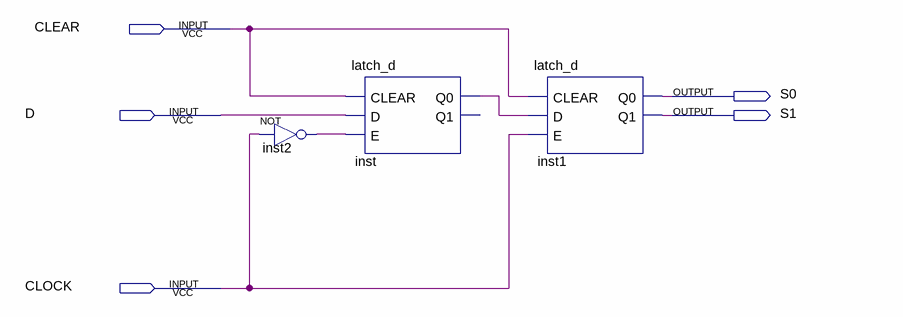
[diagram p0: schematic sheet]
// Quartus schematic flipflop_subida.bdf as structural Verilog: 3 symbols, 5 pins
module flipflop_subida (
  input  CLEAR,
  input  D,
  input  CLOCK,
  output S0,
  output S1
);

  wire inst2_out, inst_q0;

  not inst2 (inst2_out, CLOCK);
  latch_d inst (.CLEAR(CLEAR), .D(D), .E(inst2_out), .Q0(inst_q0));  // open: Q1
  latch_d inst1 (.CLEAR(CLEAR), .D(inst_q0), .E(CLOCK), .Q0(S0), .Q1(S1));
endmodule
